# EAGLE design SSB Transceiver_Speaker Amplifier (EAGLE 9.4.2)
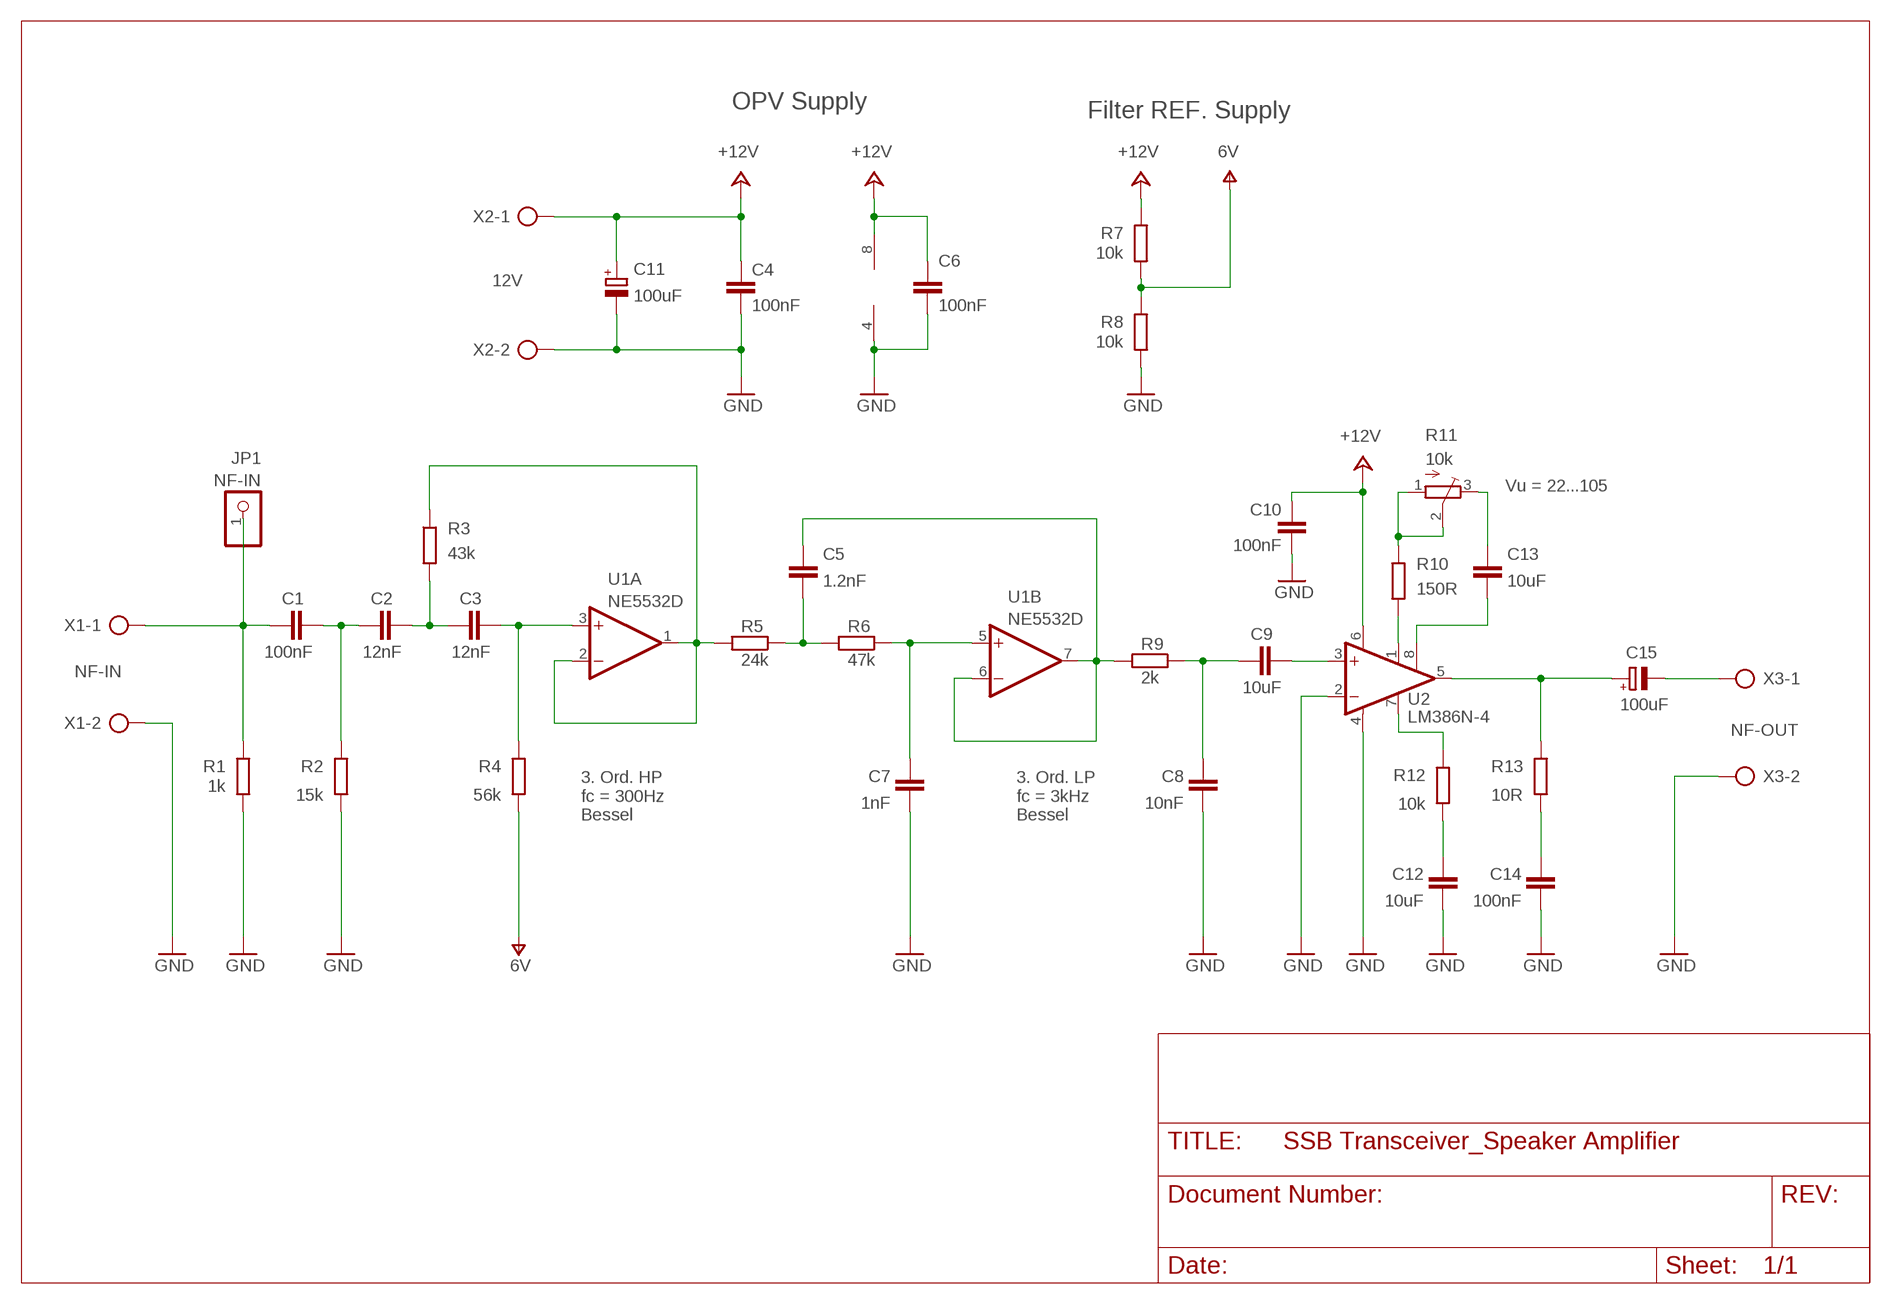
[diagram p0: schematic, sheet 1]

## Parts
C1  100nF  C-EUC0805  [C0805]
C2  12nF  C-EUC0805  [C0805]
C3  12nF  C-EUC0805  [C0805]
C4  100nF  C-EUC0805  [C0805]
C5  1.2nF  C-EUC0805  [C0805]
C6  100nF  C-EUC0805  [C0805]
C7  1nF  C-EUC0805  [C0805]
C8  10nF  C-EUC0805  [C0805]
C9  10uF  C-EUC0805  [C0805]
C10  100nF  C-EUC0805  [C0805]
C11  100uF  CPOL-EUE2.5-6  [E2,5-6]
C12  10uF  C-EUC0805  [C0805]
C13  10uF  C-EUC0805  [C0805]
C14  100nF  C-EUC0805  [C0805]
C15  100uF  CPOL-EUE2.5-6  [E2,5-6]
JP1  NF-IN  PINHD-1X1  [1X01]
R1  1k  R-EU_R0805  [R0805]
R2  15k  R-EU_R0805  [R0805]
R3  43k  R-EU_R0805  [R0805]
R4  56k  R-EU_R0805  [R0805]
R5  24k  R-EU_R0805  [R0805]
R6  47k  R-EU_R0805  [R0805]
R7  10k  R-EU_R0805  [R0805]
R8  10k  R-EU_R0805  [R0805]
R9  2k  R-EU_R0805  [R0805]
R10  150R  R-EU_R0805  [R0805]
R11  10k  TRIM_EU-3223G  [3223G]
R12  10k  R-EU_R0805  [R0805]
R13  10R  R-EU_R0805  [R0805]
U1  NE5532D  [SO08]
U2  LM386N-4  [DIL08]
X1  NF-IN  AK300/2  [AK300/2]
X2  12V  AK300/2  [AK300/2]
X3  NF-OUT  AK300/2  [AK300/2]

## Nets
+24V: C4.2 C6.2 C10.2 C11.+ R7.1 U1.8(P:V+) U2.6(VS) X2.1 ; supply symbol labelled +12V
GND: C4.1 C6.1 C7.1 C8.1 C10.1 C11.- C12.1 C14.1 R1.2 R2.2 R8.2 U1.4(P:V-) U2.2(-IN) U2.4(GND) X1.2 X2.2 X3.2
N$1: C9.2 U2.3(+IN)
N$2: R12.1 U2.7(BYPASS)
N$3: C12.2 R12.2
N$4: C1.1 JP1.1 R1.1 X1.1
N$5: C15.+ R13.1 U2.5(OUT)
N$6: C14.2 R13.2
N$7: R10.2 U2.1(GAIN)
N$9: C1.2 C2.1 R2.1
N$10: C13.2 R11.3(E)
N$11: C15.- X3.1
N$12: C13.1 U2.8(GAIN)
N$13: R3.1 R5.2 U1.1(A:OUT) U1.2(A:-IN)
N$14: C2.2 C3.1 R3.2
N$15: C3.2 R4.1 U1.3(A:+IN)
N$16: C5.1 R5.1 R6.2
N$17: C7.2 R6.1 U1.5(B:+IN)
N$18: C5.2 R9.2 U1.6(B:-IN) U1.7(B:OUT)
N$19: C8.2 C9.1 R9.1
N$20: R10.1 R11.1(A) R11.2(S)
V+: R4.2 R7.2 R8.1 ; supply symbol labelled 6V

## Notes on the sheet
- OPV Supply
- Filter REF. Supply
- Vu = 22...105
- 3. Ord. HP
  fc = 300Hz
  Bessel
- 3. Ord. LP
  fc = 3kHz
  Bessel

## Library data of the parts
C1-C10 C12-C14 = rcl:C-EU: CAPACITOR, European symbol; SPICEPREFIX: C
C11 C15 = rcl:CPOL-EU: POLARIZED CAPACITOR, European symbol; SPICEPREFIX: C
JP1 = pinhead:PINHD-1X1: PIN HEADER
R1-R10 R12 R13 = rcl:R-EU_: RESISTOR, European symbol; SPICEPREFIX: R
R11 = pot:TRIM_EU-: POTENTIOMETER
U1 = linear:NE5532: AUDIO AMPLIFIER
U2 = Ham Radio:LM386?-*: Low Voltage Audio Power Amplifier Source: http://cache.national.com/ds/LM/LM386.pdf
X1-X3 = con-ptr500:AK300/2: CONNECTOR; OC_FARNELL: unknown; OC_NEWARK: unknown

## Board
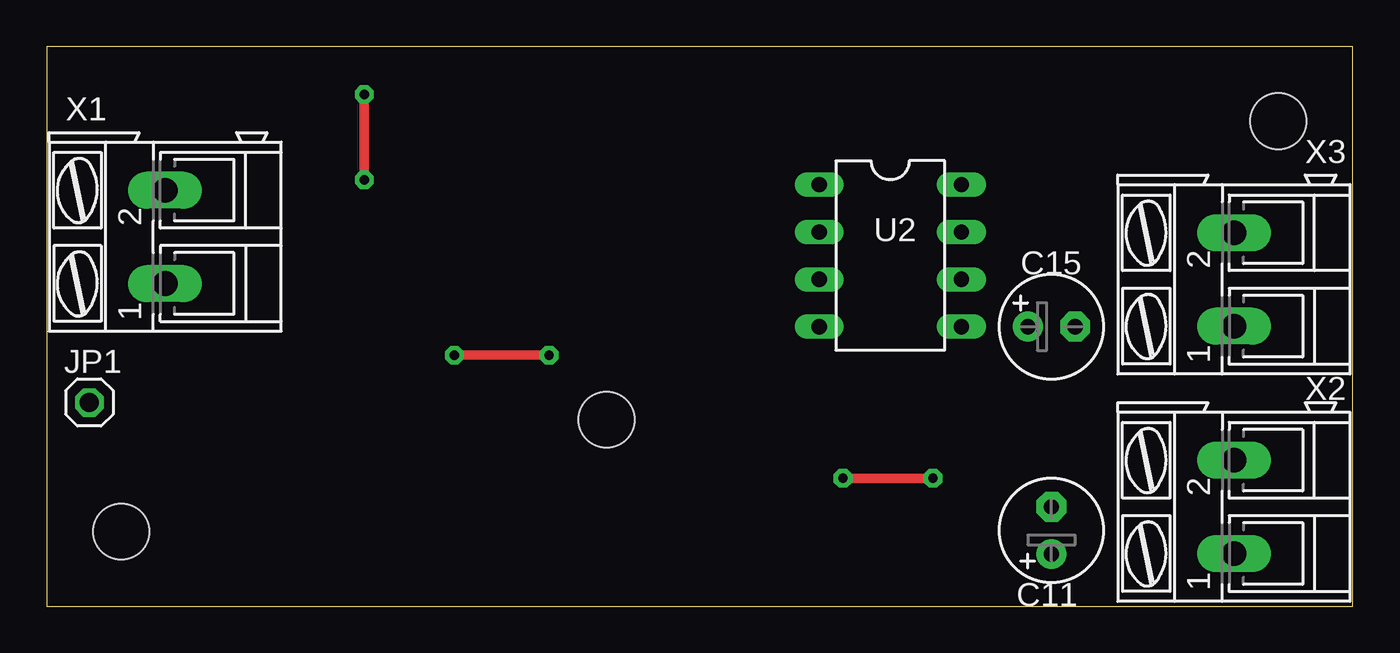
[diagram p1: board, top side]
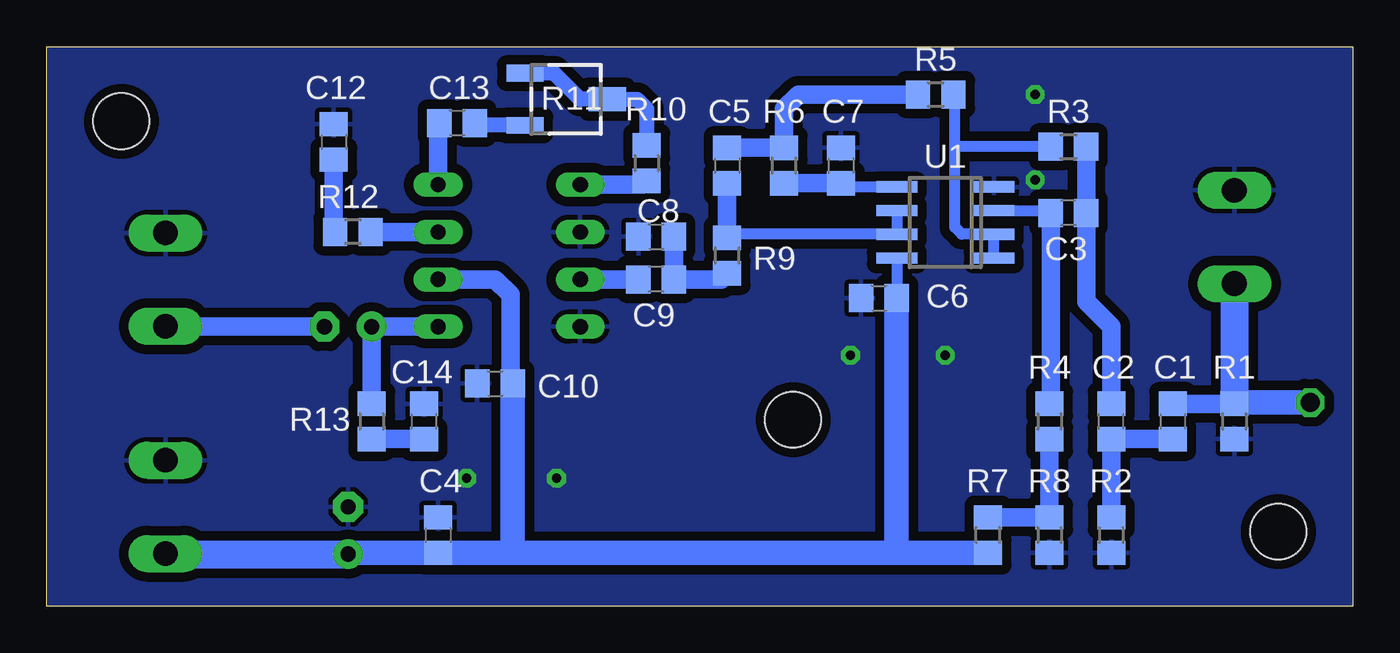
[diagram p2: board, bottom side, seen from below]

Size 70 x 30 mm. Coordinates in mm from the lower left corner, seen from the top.
Outline: 0,0 70,0 70,30 0,30 0,0
Copper layers (1*16): Top 0.035mm / dielectric 1.5mm / Bottom 0.035mm
Design rules "default *": minimum track width 6mil, minimum drill 0.35mm, track to track 20mil, track to pad 20mil, pad to pad 20mil, via to via 20mil, smd to smd 6mil, copper to edge 0mil, drill to drill 6mil, minimum pad ring 10mil, minimum via ring 8mil, stop-mask expansion 4mil, vias tented up to drill 0mil, thermal gap 10mil
Holes 3 mm at 66,26 30,10 4,4

### Footprints (pad centres in the part's own frame; a part is rotated, then mirrored left to right if it is on the bottom)
C0805 = smd 1.3 x 1.5: 1 -0.95,0; 2 0.95,0
E2,5-6 = drill 0.813 pad 1.6: + -1.27,0 | drill 0.813 pad 1.6 octagon: - 1.27,0
1X01 = drill 1.016 octagon: 1 0,0
R0805 = smd 1.3 x 1.5: 1 -0.95,0; 2 0.95,0
3223G = smd 2 x 0.9: 1 -2.2,1.4; 3 -2.2,-1.4 | smd 2 x 1.3: 2 2.2,0
SO08 = smd 0.6 x 2.2: 1 -1.905,-2.6; 2 -0.635,-2.6; 3 0.635,-2.6; 4 1.905,-2.6; 5 1.905,2.6; 6 0.635,2.6; 7 -0.635,2.6; 8 -1.905,2.6
DIL08 = drill 0.813 pad 1.27 long: 1 -3.81,-3.81; 2 -1.27,-3.81; 3 1.27,-3.81; 4 3.81,-3.81; 5 3.81,3.81; 6 1.27,3.81; 7 -1.27,3.81; 8 -3.81,3.81
AK300/2 = drill 1.321 long: 1 -2.515,0; 2 2.489,0

### Placement (x,y rotation side)
C1  9.65,9.91 270 bottom
C2  12.95,9.91 90 bottom
C3  15.24,21.08 180 bottom
C4  49.02,3.81 270 bottom
C5  33.53,23.62 270 bottom
C6  25.4,16.51 0 bottom
C7  27.43,23.62 270 bottom
C8  37.34,19.81 0 bottom
C9  37.34,17.53 180 bottom
C10  45.97,11.94 0 bottom
C11  53.85,4.06 90 top
C12  54.61,24.89 270 bottom
C13  48.01,25.91 0 bottom
C14  49.78,9.91 270 bottom
C15  53.85,14.99 0 top
JP1  2.29,10.92 0 top
R1  6.35,9.91 270 bottom
R2  12.95,3.81 270 bottom
R3  15.24,24.64 0 bottom
R4  16.26,9.91 270 bottom
R5  22.35,27.43 0 bottom
R6  30.48,23.62 90 bottom
R7  19.56,3.81 90 bottom
R8  16.26,3.81 270 bottom
R9  33.53,18.8 90 bottom
R10  37.85,23.75 270 bottom
R11  42.16,27.18 0 bottom
R12  53.59,20.07 180 bottom
R13  52.58,9.91 270 bottom
U1  21.84,20.57 90 bottom
U2  45.21,18.8 270 top
X1  6.35,19.81 90 top
X2  63.63,5.33 90 top
X3  63.63,17.53 90 top

### Tracks (layer width: path | path; a pad name or v marks a point on that pad's centre or on a via)
+24V
  Bottom 0.6: U1.8 C6.2
  Bottom 1: U2.6 45.97,17.53 45.15,16.7 45.15,12.06 C10.2
  Bottom 1.3: C11.+ 53.78,2.86 C4.2 44.7,2.86 | 24.38,2.86 R7.1 | C6.2 24.45,2.93 24.38,2.86 | 44.7,2.86 24.38,2.86 | C10.2 45.02,3.18 44.7,2.86
  Bottom 1.5: X2.1 63.6,2.79 C11.+
GND  (via drill 0.5 pad 1)
  Top 0.5: v17.02,27.43 v17.02,22.86 | v21.84,13.46 v26.92,13.46 | v47.5,6.86 v42.67,6.86
  pour Bottom (isolate 0.5): 0,0 0,30 70,30 70,0
N$1
  Bottom 1: C9.2 U2.3
N$2
  Bottom 1: U2.7 R12.1
N$3
  Bottom 1: C12.2 54.61,20.13 R12.2
N$4
  Bottom 1: C1.1 R1.1 | 6.28,10.92 R1.1 | 6.35,11.43 6.35,10.99 R1.1
  Bottom 1.3: JP1.1 6.28,10.92 6.35,10.99
  Bottom 1.5: X1.1 6.35,11.43
N$5
  Bottom 1: U2.5 C15.+ R13.1
N$6
  Bottom 1: C14.2 R13.2
N$7
  Bottom 1: U2.1 38.04,22.61 R10.2
N$9
  Bottom 1: R2.1 C2.1 C1.2
N$10
  Bottom 0.8: R11.3 46.93,25.78 C13.2
N$11
  Bottom 1: C15.- 63.6,14.99 X3.1
N$12
  Bottom 1: C13.1 49.02,25.84 U2.8
N$13
  Bottom 0.6: U1.1 U1.2 20.95,19.94 21.34,20.32 21.34,24.64 | R5.2 21.34,27.37 21.34,24.64 | R3.1 21.34,24.64
N$14
  Bottom 1: R3.2 C3.1 14.29,16.32 12.95,14.99 C2.2
N$15
  Bottom 0.6: U1.3 16.32,21.21 C3.2
  Bottom 1: C3.2 16.19,10.92 R4.1
N$16
  Bottom 1: C5.1 R6.2 30.48,26.67 29.72,27.43 R5.1
N$17
  Bottom 0.6: U1.5 27.24,22.48 C7.2
  Bottom 1: C7.2 R6.1
N$18
  Bottom 0.6: U1.6 U1.7 33.34,19.94 R9.2
  Bottom 1: C5.2 R9.2
N$19
  Bottom 1: R9.1 33.85,17.53 C9.1 C8.2
N$20
  Bottom 0.8: R11.1 42.8,28.58 41.4,27.18 R11.2 38.35,27.18 37.85,26.67 R10.1
V+
  Bottom 1: R7.2 R8.1 R4.2